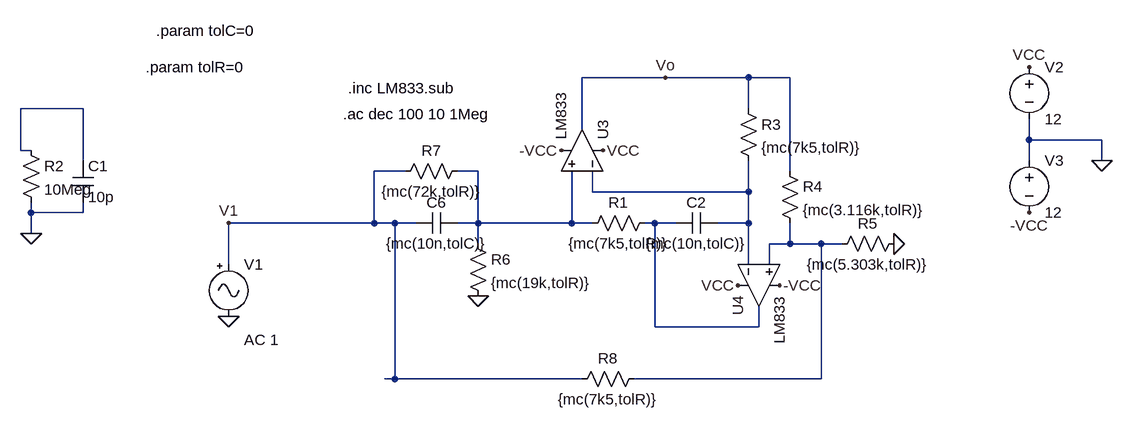
[diagram p0: schematic GIC_1.asc]
GIC_1.asc, the LTspice schematic file:
Version 4
SHEET 1 1208 680
WIRE 416 -64 288 -64
WIRE 544 -64 416 -64
WIRE 608 -64 544 -64
WIRE -480 -16 -576 -16
WIRE 544 -16 544 -64
WIRE 288 16 288 -64
WIRE 976 32 976 0
WIRE 1088 32 976 32
WIRE -576 48 -576 -16
WIRE -560 48 -576 48
WIRE -480 64 -480 -16
WIRE 976 64 976 32
WIRE 1088 64 1088 32
WIRE 16 80 -32 80
WIRE 128 80 96 80
WIRE 608 80 608 -64
WIRE 304 112 304 80
WIRE 544 112 544 64
WIRE 544 112 304 112
WIRE -560 144 -560 128
WIRE -480 144 -480 128
WIRE -480 144 -560 144
WIRE -32 160 -32 80
WIRE -32 160 -256 160
WIRE 0 160 -32 160
WIRE 32 160 0 160
WIRE 128 160 128 80
WIRE 128 160 96 160
WIRE 272 160 272 80
WIRE 272 160 128 160
WIRE 304 160 272 160
WIRE 400 160 384 160
WIRE 432 160 400 160
WIRE 544 160 544 112
WIRE 544 160 496 160
WIRE -560 176 -560 144
WIRE 128 192 128 160
WIRE 608 192 608 160
WIRE 608 192 576 192
WIRE 656 192 608 192
WIRE 688 192 656 192
WIRE -256 224 -256 160
WIRE 544 224 544 160
WIRE 576 224 576 192
WIRE 400 320 400 160
WIRE 560 320 560 288
WIRE 560 320 400 320
WIRE 0 400 0 160
WIRE 0 400 -16 400
WIRE 288 400 0 400
WIRE 656 400 656 192
WIRE 656 400 368 400
FLAG 128 272 0
FLAG 768 192 0
FLAG 416 -64 Vo
FLAG 1088 64 0
FLAG 976 -80 VCC
FLAG 976 144 -VCC
FLAG -256 304 0
FLAG -256 160 V1
FLAG 320 48 VCC
FLAG 528 256 VCC
FLAG 256 48 -VCC
FLAG 592 256 -VCC
FLAG -560 176 0
SYMBOL res 112 64 R90
WINDOW 0 0 56 VBottom 2
WINDOW 3 32 56 VTop 2
SYMATTR InstName R7
SYMATTR Value {mc(72k,tolR)}
SYMBOL cap 96 144 R90
WINDOW 0 0 32 VBottom 2
WINDOW 3 32 32 VTop 2
SYMATTR InstName C6
SYMATTR Value {mc(10n,tolC)}
SYMBOL res 112 176 R0
SYMATTR InstName R6
SYMATTR Value {mc(19k,tolR)}
SYMBOL res 400 144 R90
WINDOW 0 0 56 VBottom 2
WINDOW 3 32 56 VTop 2
SYMATTR InstName R1
SYMATTR Value {mc(7k5,tolR)}
SYMBOL cap 496 144 R90
WINDOW 0 0 32 VBottom 2
WINDOW 3 32 32 VTop 2
SYMATTR InstName C2
SYMATTR Value {mc(10n,tolC)}
SYMBOL res 528 -32 R0
SYMATTR InstName R3
SYMATTR Value {mc(7k5,tolR)}
SYMBOL res 592 64 R0
SYMATTR InstName R4
SYMATTR Value {mc(3.116k,tolR)}
SYMBOL res 784 176 R90
WINDOW 0 0 56 VBottom 2
WINDOW 3 32 56 VTop 2
SYMATTR InstName R5
SYMATTR Value {mc(5.303k,tolR)}
SYMBOL Misc\\signal -256 208 R0
WINDOW 123 24 132 Left 2
WINDOW 39 24 44 Left 2
SYMATTR Value2 AC 1
SYMATTR InstName V1
SYMATTR Value ""
SYMBOL voltage 976 -96 R0
WINDOW 123 0 0 Left 2
WINDOW 39 0 0 Left 2
SYMATTR InstName V2
SYMATTR Value 12
SYMBOL voltage 976 48 R0
WINDOW 123 0 0 Left 2
WINDOW 39 0 0 Left 2
SYMATTR InstName V3
SYMATTR Value 12
SYMBOL res 384 384 R90
WINDOW 0 0 56 VBottom 2
WINDOW 3 32 56 VTop 2
SYMATTR InstName R8
SYMATTR Value {mc(7k5,tolR)}
SYMBOL Opamps\\opamp2 352 48 M270
SYMATTR InstName U3
SYMATTR Value LM833
SYMBOL Opamps\\opamp2 496 256 M90
SYMATTR InstName U4
SYMATTR Value LM833
SYMBOL res -576 32 R0
SYMATTR InstName R2
SYMATTR Value 10Meg
SYMBOL cap -496 64 R0
SYMATTR InstName C1
SYMATTR Value 10p
TEXT -80 -8 Left 2 !.ac dec 100 10 1Meg
TEXT -72 -48 Left 2 !.inc LM833.sub
TEXT -384 -80 Left 2 !.param tolR=0
TEXT -368 -136 Left 2 !.param tolC=0

The netlist it stands for:
* GIC_1.asc
R7 N002 V1 {mc(72k,tolR)}
C6 N002 V1 {mc(10n,tolC)}
R6 N002 0 {mc(19k,tolR)}
R1 N004 N002 {mc(7k5,tolR)}
C2 N003 N004 {mc(10n,tolC)}
R3 Vo N003 {mc(7k5,tolR)}
R4 Vo N005 {mc(3.116k,tolR)}
R5 0 N005 {mc(5.303k,tolR)}
V1 V1 0 AC 1
V2 VCC 0 12
V3 0 -VCC 12
R8 N005 V1 {mc(7k5,tolR)}
XU3 N002 N003 VCC -VCC Vo LM833  ; pins In+ In- V+ V- OUT
XU4 N005 N003 VCC -VCC N004 LM833  ; pins In+ In- V+ V- OUT
R2 N001 0 10Meg
C1 N001 0 10p
.ac dec 100 10 1Meg
.inc LM833.sub
.param tolR=0
.param tolC=0
.backanno
.end